# Altium schematic sheet fpga-bank6.SchDoc: FPGA - Bank 6
size Legal; CheckedBy: J. Brinton; CompanyName: Signal Laboratories, Inc.; DrawnBy: J. Brinton; Engineer: J. Brinton; Address1: 3479 Edison Way; Address2: Menlo Park CA 94025; Address3: +1 (877) 778-8435; Address4: siglabs.com; DocumentNumber: 32; Revision: 2b; SheetNumber: 33; SheetTotal: 58
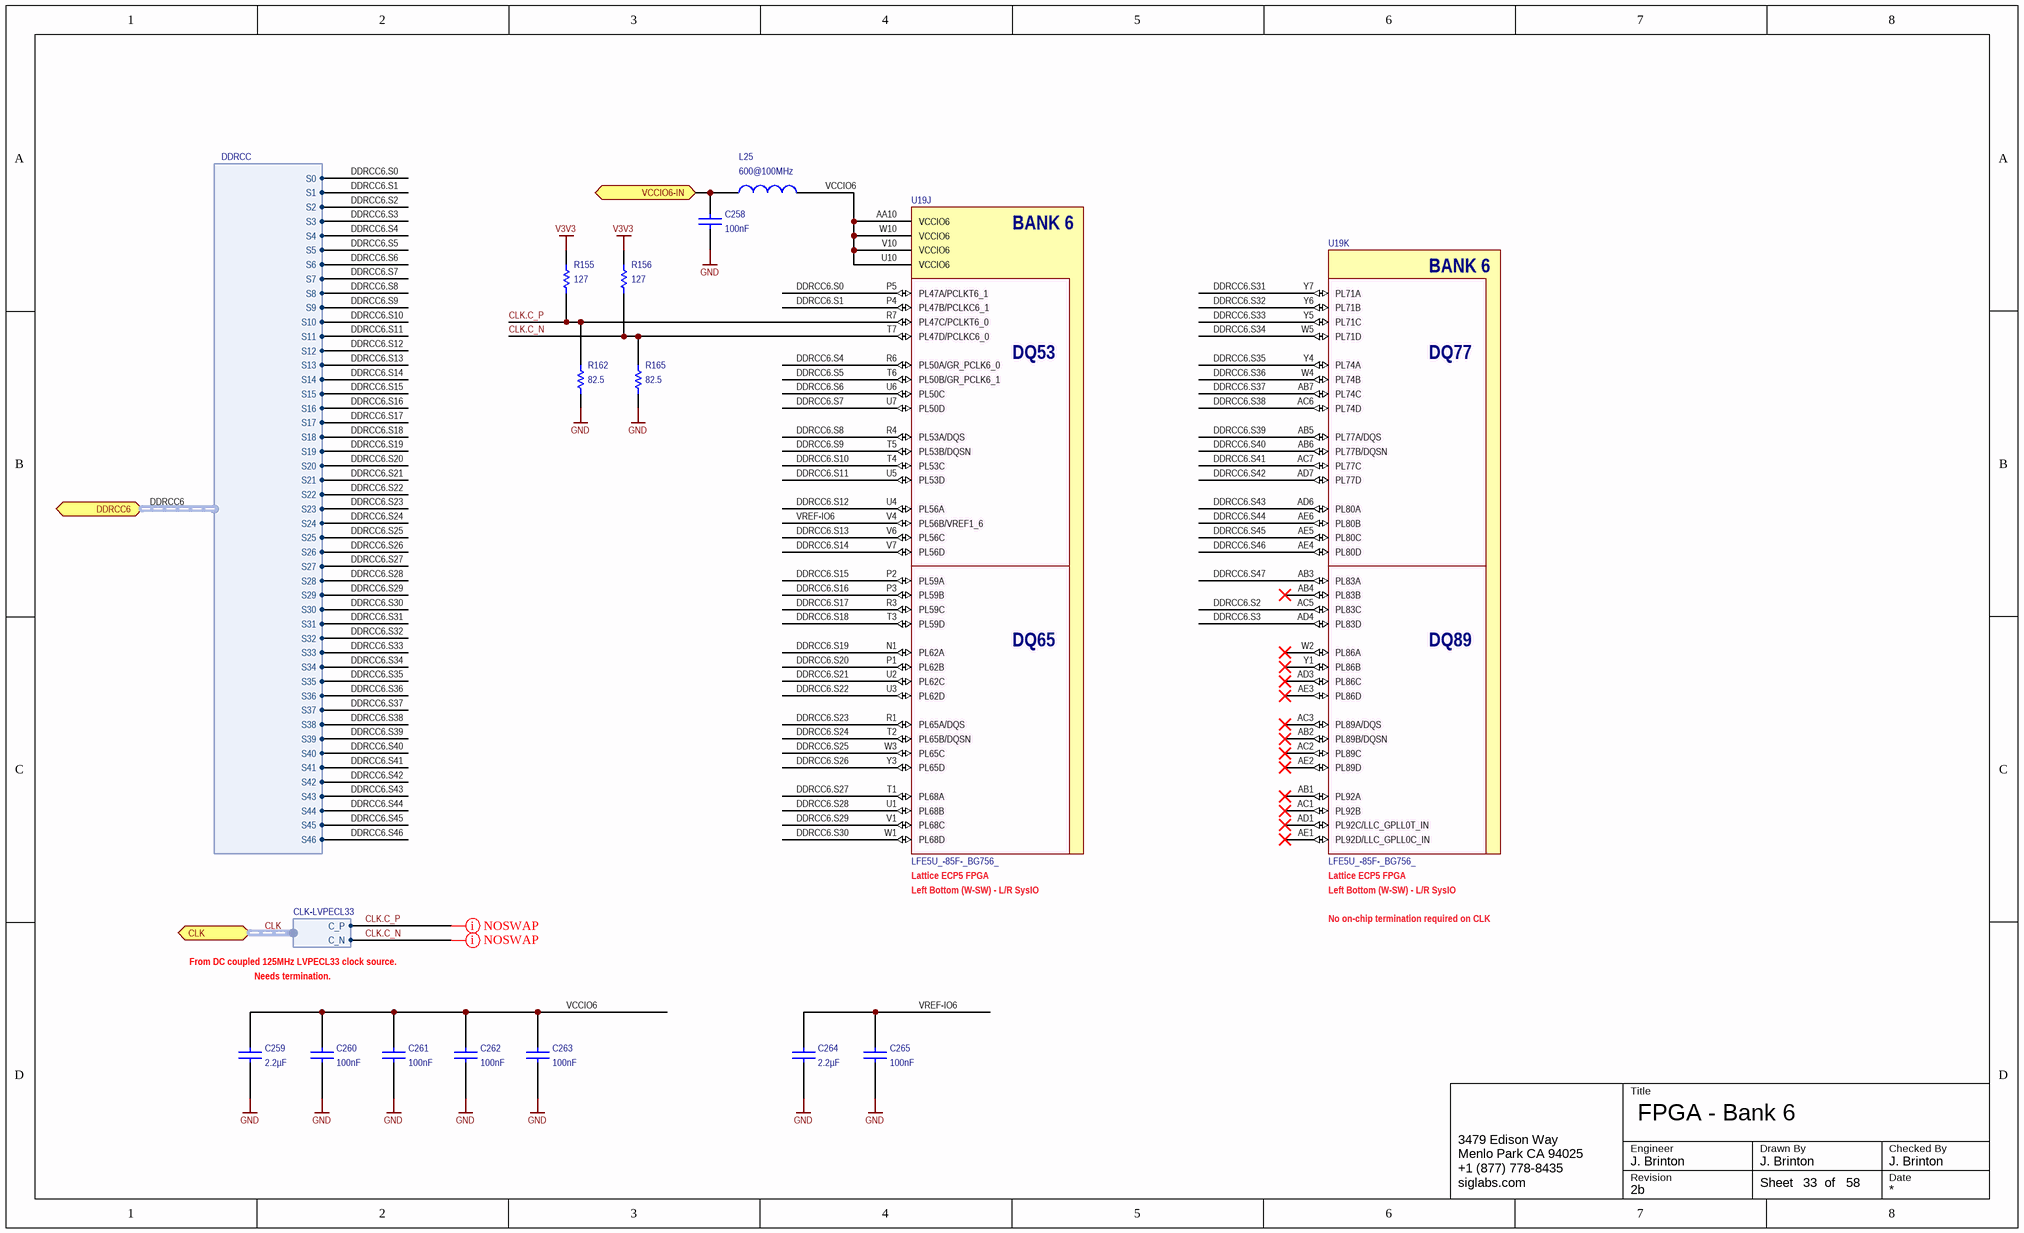
[diagram p0: fpga-bank6.SchDoc]

## Parts
C258  value 100nF  [CAPC1005X56N]  (hidden comment: GRM155R71C104KA88J)
C259  value 2.2µF  [CAPC1608X90N]  (hidden comment: GRM21BR71C225KA12L)
C260  value 100nF  [CAPC1005X56N]  (hidden comment: GRM155R71C104KA88J)
C261  value 100nF  [CAPC1005X56N]  (hidden comment: GRM155R71C104KA88J)
C262  value 100nF  [CAPC1005X56N]  (hidden comment: GRM155R71C104KA88J)
C263  value 100nF  [CAPC1005X56N]  (hidden comment: GRM155R71C104KA88J)
C264  value 2.2µF  [CAPC1608X90N]  (hidden comment: GRM21BR71C225KA12L)
C265  value 100nF  [CAPC1005X56N]  (hidden comment: GRM155R71C104KA88J)
L25  value 600@100MHz  [0402]  (hidden comment: BLM15PX601SN1D)
R155  value 127  [0402]  (hidden comment: ERA-2AEB1270X)
R156  value 127  [0402]  (hidden comment: ERA-2AEB1270X)
R162  value 82.5  [0402]  (hidden comment: ERA-2AEB82R5X)
R165  value 82.5  [0402]  (hidden comment: ERA-2AEB82R5X)
U19  LFE5U_-85F-_BG756_  [caBGA756]  (parts J,K of 19)

## Ports
CLK (harness CLK-LVPECL33), DDRCC6 (harness DDRCC), VCCIO6-IN

## Harnesses
DDRCC: S0, S1, S2, S3, S4, S5, S6, S7, S8, S9, S10, S11, S12, S13, S14, S15, S16, S17, S18, S19, S20, S21, S22, S23, S24, S25, S26, S27, S28, S29, S30, S31, S32, S33, S34, S35, S36, S37, S38, S39, S40, S41, S42, S43, S44, S45, S46
CLK-LVPECL33: C_P, C_N

## Nets
GND: C258.1 C259.1 C260.1 C261.1 C262.1 C263.1 C264.1 C265.1 R162.1 R165.1
V3V3: R155.2 R156.2
CLK.C_N: R156.1 R165.2 U19.T7(PL47D/PCLKC6_0) ; port CLK.C_N
CLK.C_P: R155.1 R162.2 U19.R7(PL47C/PCLKT6_0) ; port CLK.C_P
DDRCC6.S0: U19.P5(PL47A/PCLKT6_1) ; port DDRCC6.S0
DDRCC6.S1: U19.P4(PL47B/PCLKC6_1) ; port DDRCC6.S1
DDRCC6.S2: U19.AC5(PL83C) ; port DDRCC6.S2
DDRCC6.S3: U19.AD4(PL83D) ; port DDRCC6.S3
DDRCC6.S4: U19.R6(PL50A/GR_PCLK6_0) ; port DDRCC6.S4
DDRCC6.S5: U19.T6(PL50B/GR_PCLK6_1) ; port DDRCC6.S5
DDRCC6.S6: U19.U6(PL50C) ; port DDRCC6.S6
DDRCC6.S7: U19.U7(PL50D) ; port DDRCC6.S7
DDRCC6.S8: U19.R4(PL53A/DQS) ; port DDRCC6.S8
DDRCC6.S9: U19.T5(PL53B/DQSN) ; port DDRCC6.S9
DDRCC6.S10: U19.T4(PL53C) ; port DDRCC6.S10
DDRCC6.S11: U19.U5(PL53D) ; port DDRCC6.S11
DDRCC6.S12: U19.U4(PL56A) ; port DDRCC6.S12
DDRCC6.S13: U19.V6(PL56C) ; port DDRCC6.S13
DDRCC6.S14: U19.V7(PL56D) ; port DDRCC6.S14
DDRCC6.S15: U19.P2(PL59A) ; port DDRCC6.S15
DDRCC6.S16: U19.P3(PL59B) ; port DDRCC6.S16
DDRCC6.S17: U19.R3(PL59C) ; port DDRCC6.S17
DDRCC6.S18: U19.T3(PL59D) ; port DDRCC6.S18
DDRCC6.S19: U19.N1(PL62A) ; port DDRCC6.S19
DDRCC6.S20: U19.P1(PL62B) ; port DDRCC6.S20
DDRCC6.S21: U19.U2(PL62C) ; port DDRCC6.S21
DDRCC6.S22: U19.U3(PL62D) ; port DDRCC6.S22
DDRCC6.S23: U19.R1(PL65A/DQS) ; port DDRCC6.S23
DDRCC6.S24: U19.T2(PL65B/DQSN) ; port DDRCC6.S24
DDRCC6.S25: U19.W3(PL65C) ; port DDRCC6.S25
DDRCC6.S26: U19.Y3(PL65D) ; port DDRCC6.S26
DDRCC6.S27: U19.T1(PL68A) ; port DDRCC6.S27
DDRCC6.S28: U19.U1(PL68B) ; port DDRCC6.S28
DDRCC6.S29: U19.V1(PL68C) ; port DDRCC6.S29
DDRCC6.S30: U19.W1(PL68D) ; port DDRCC6.S30
DDRCC6.S31: U19.Y7(PL71A) ; port DDRCC6.S31
DDRCC6.S32: U19.Y6(PL71B) ; port DDRCC6.S32
DDRCC6.S33: U19.Y5(PL71C) ; port DDRCC6.S33
DDRCC6.S34: U19.W5(PL71D) ; port DDRCC6.S34
DDRCC6.S35: U19.Y4(PL74A) ; port DDRCC6.S35
DDRCC6.S36: U19.W4(PL74B) ; port DDRCC6.S36
DDRCC6.S37: U19.AB7(PL74C) ; port DDRCC6.S37
DDRCC6.S38: U19.AC6(PL74D) ; port DDRCC6.S38
DDRCC6.S39: U19.AB5(PL77A/DQS) ; port DDRCC6.S39
DDRCC6.S40: U19.AB6(PL77B/DQSN) ; port DDRCC6.S40
DDRCC6.S41: U19.AC7(PL77C) ; port DDRCC6.S41
DDRCC6.S42: U19.AD7(PL77D) ; port DDRCC6.S42
DDRCC6.S43: U19.AD6(PL80A) ; port DDRCC6.S43
DDRCC6.S44: U19.AE6(PL80B) ; port DDRCC6.S44
DDRCC6.S45: U19.AE5(PL80C) ; port DDRCC6.S45
DDRCC6.S46: U19.AE4(PL80D) ; port DDRCC6.S46
DDRCC6.S47: U19.AB3(PL83A)
VCCIO6: C259.2 C260.2 C261.2 C262.2 C263.2 L25.1 U19.AA10(VCCIO6) U19.U10(VCCIO6) U19.V10(VCCIO6) U19.W10(VCCIO6)
VCCIO6-IN: C258.2 L25.2 ; port VCCIO6-IN
VREF-IO6: C264.2 C265.2 U19.V4(PL56B/VREF1_6)

Not connected (* = marked no-connect by the designer): U19 AB1(PL92A)* AB2(PL89B/DQSN)* AB4(PL83B)* AC1(PL92B)* AC2(PL89C)* AC3(PL89A/DQS)* AD1(PL92C/LLC_GPLL0T_IN)* AD3(PL86C)* AE1(PL92D/LLC_GPLL0C_IN)* AE2(PL89D)* AE3(PL86D)* W2(PL86A)* Y1(PL86B)*

## Buses and harness runs
harness CLK = port CLK
harness DDRCC6 = port DDRCC6

## Layout directives
net class NOSWAP: CLK.C_N, CLK.C_P

## Notes on the sheet
- (near U19) Left Bottom (W-SW) - L/R SysIO
- (near U19) Lattice ECP5 FPGA
- From DC coupled 125MHz LVPECL33 clock source.
- No on-chip termination required on CLK
- Needs termination.
- Title
- Engineer
- Revision
- Drawn By
- Checked By
- Date
- Sheet
- of
- (in symbol LFE5U_-85F-_BG756_, part J) BANK 6; DQ53; DQ65
- (in symbol LFE5U_-85F-_BG756_, part K) BANK 6; DQ77; DQ89

## Library data of the parts
C258 C260-C263 C265 = GRM155R71A104KA01J: Ceramic Capacitor 100nF ±10% 16V X7R 0402; Manufacturer: Murata; Tr: -55:125; Manufacturer P/N: GRM155R71C104KA88J; Tolerance: ±10%; Package: 0402; Voltage: 16V
C259 C264 = GRM188R71A225KE15D: Ceramic Capacitor 2.2uF ±10% 10V X7R 0603; Manufacturer: Murata; Tr: -55:125; Manufacturer P/N: GRM188R71A225KE15D; Tolerance: ±10%; Package: 0603; Voltage: 10V
L25 = IND 0402: Ferrite Bead 600-Ohm @ 100MHz 900mA 0402; Manufacturer: Murata; Tolerance: ±25%; Tr: -55:125; Manufacturer P/N: BLM15PX601SN1D; Package: 0402
R155 R156 = RES 0402: Thin Film Resistor 127 ±0.1% 0402; Manufacturer: Panasonic; Tr: -55:155; Package: 0402; Manufacturer P/N: ERA-2AEB1270X; Do Not Place: *; Tolerance: ±0.1%
R162 R165 = RES 0402: Thin Film Resistor 82.5 ±0.1% 0402; Manufacturer: Panasonic; Tr: -55:155; Package: 0402; Manufacturer P/N: ERA-2AEB82R5X; Do Not Place: *; Tolerance: ±0.1%
U19 = LFE5U_-85F-_BG756_: ECP5 FPGA, 85k LUT, 756-caBGA; Manufacturer: Lattice Semiconductor; Manufacturer P/N: LFE5U_-85F-_BG756_